# Altium project SensorModule_Digital.PrjPcb
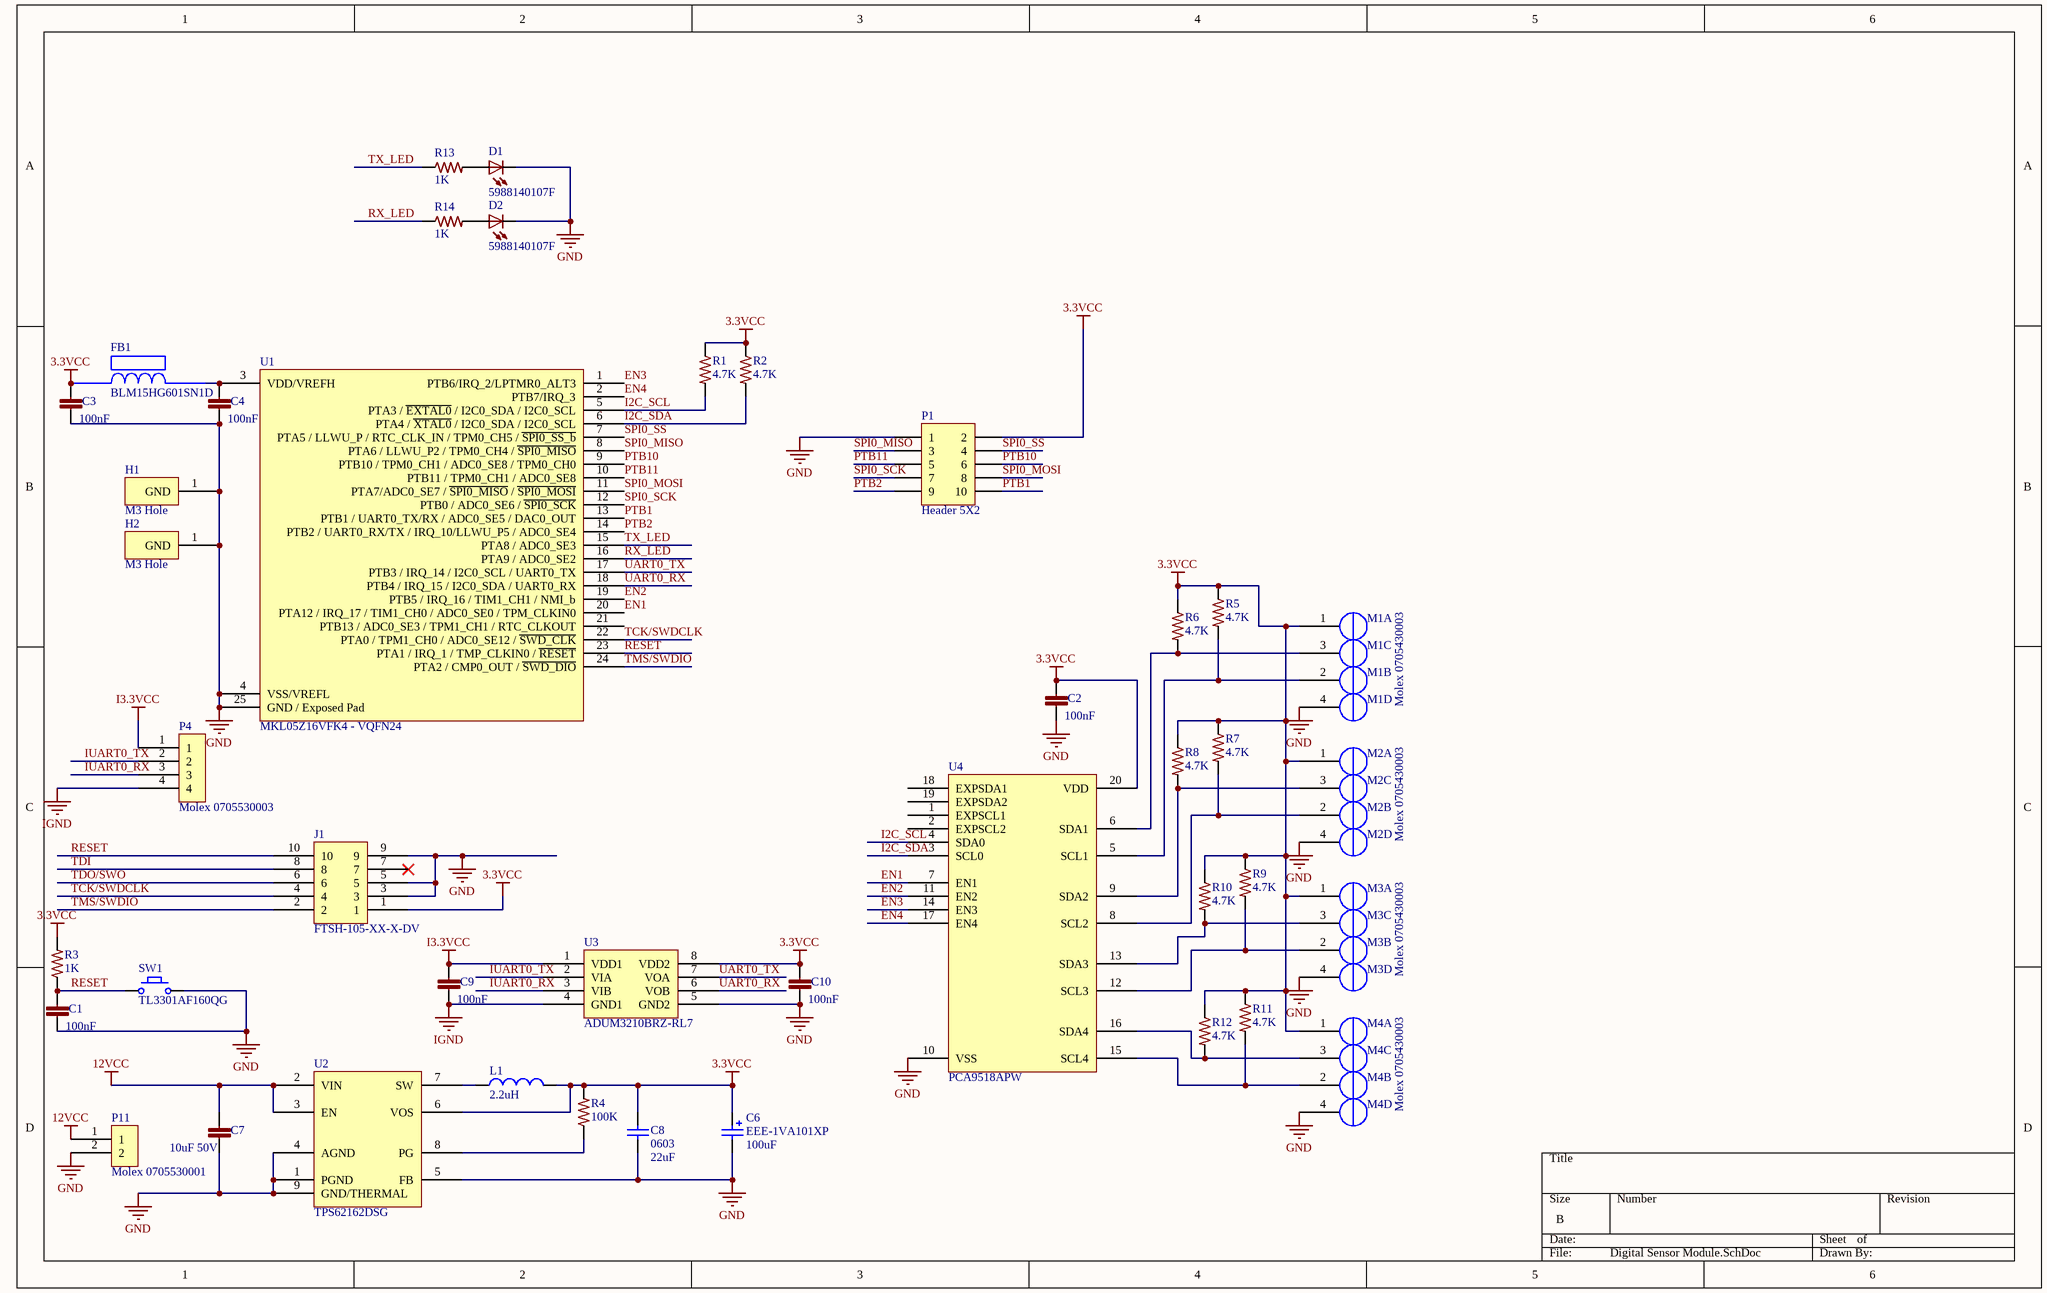
[diagram p0: Digital Sensor Module.SchDoc]
1 sheet, 42 parts. Net scope: global (net labels, ports and power ports of the same name join across sheets).
Board file: Digital Sensor Module.PcbDoc

## Sheet Digital Sensor Module.SchDoc
size B

### Parts
C1  100nF  [C0402]
C2  100nF  [C0402]
C3  100nF  [C0402]
C4  100nF  [C0402]
C6  EEE-1VA101XP  value 100uF  [EEE-1VA101XP]
C7  10uF 50V  [C1206]
C8  0603  value 22uF  [C0805]
C9  100nF  [C0402]
C10  100nF  [C0402]
D1  5988140107F  [LED2012120]
D2  5988140107F  [LED2012120]
FB1  BLM15HG601SN1D  [BLM18PG121SN1D]
H1  M3 Hole  [Hole-3mm]
H2  M3 Hole  [Hole-3mm]
J1  FTSH-105-XX-X-DV  [FTSH-105-XX-X-DV]
L1  value 2.2uH  [VLS252012T-2R2M1R3]  (hidden comment: VLS252012T-2R2M1R3)
M1  Molex 0705430003  [4POL254]  (parts A,B,C,D of 4)
M2  Molex 0705430003  [4POL254]  (parts A,B,C,D of 4)
M3  Molex 0705430003  [4POL254]  (parts A,B,C,D of 4)
M4  Molex 0705430003  [4POL254]  (parts A,B,C,D of 4)
P1  Header 5X2  [HDR2X5]
P4  Molex 0705530003  [0705530003]
P11  Molex 0705530001  [0705530001]
R1  4.7K  [R0603]
R2  4.7K  [R0603]
R3  1K  [R0603]
R4  100K  [R0603]
R5  4.7K  [R0603]
R6  4.7K  [R0603]
R7  4.7K  [R0603]
R8  4.7K  [R0603]
R9  4.7K  [R0603]
R10  4.7K  [R0603]
R11  4.7K  [R0603]
R12  4.7K  [R0603]
R13  1K  [R0603]
R14  1K  [R0603]
SW1  TL3301AF160QG  [TL3301AF160QG]
U1  MKL05Z16VFK4 - VQFN24  [98ASA00474D]
U2  TPS62162DSG  [DSG8-1600X900TP]
U3  ADUM3210BRZ-RL7  [ADUM3210BRZ-RL7]
U4  PCA9518APW  [PCA9518APW,512]

### Nets
3.3VCC: C2.1 C3.1 C6.1 C8.2 C10.1 FB1.1 J1.1 L1.2 M1.1(OUT2B) M2.1(OUT2B) M3.1(OUT2B) M4.1(OUT2B) P1.2 R1.1 R2.1 R3.2 R4.2 R5.1 R6.1 R7.1 R8.1 R9.1 R10.1 R11.1 R12.1 U2.6(VOS) U3.8(VDD2) U4.20(VDD)
12VCC: C7.1 P11.1 U2.2(VIN) U2.3(EN)
GND: C1.2 C2.2 C3.2 C4.2 C6.2 C7.2 C8.1 C10.2 D1.C D2.C H1.1(GND) H2.1(GND) J1.3 J1.5 J1.9 M1.4(OUT1B) M2.4(OUT1B) M3.4(OUT1B) M4.4(OUT1B) P1.1 P11.2 SW1.2 U1.4(VSS/VREFL) U1.25(GND_/_Exposed_Pad) U2.1(PGND) U2.4(AGND) U2.5(FB) U2.9(GND/THERMAL) U3.5(GND2) U4.10(VSS)
I3.3VCC: C9.1 P4.1 U3.1(VDD1)
IGND: C9.2 P4.4 U3.4(GND1)
EN1: U1.20(PTA12_/_IRQ_17_/_TIM1_CH0_/_ADC0_SE0_/_TPM_CLKIN0) U4.7(EN1)
EN2: U1.19(PTB5_/_IRQ_16_/_TIM1_CH1_/_NMI_b) U4.11(EN2)
EN3: U1.1(PTB6/IRQ_2/LPTMR0_ALT3) U4.14(EN3)
EN4: U1.2(PTB7/IRQ_3) U4.17(EN4)
I2C_SCL: R1.2 U1.5(PTA3_/_~{EXTAL0}_/_I2C0_SDA_/_I2C0_SCL) U4.4(SDA0)
I2C_SDA: R2.2 U1.6(PTA4_/_~{XTAL0}_/_I2C0_SDA_/_I2C0_SCL) U4.3(SCL0)
IUART0_RX: P4.3 U3.3(VIB)
IUART0_TX: P4.2 U3.2(VIA)
PTB1: P1.10 U1.13(PTB1_/_UART0_TX/RX_/_ADC0_SE5_/_DAC0_OUT)
PTB2: P1.9 U1.14(PTB2_/_UART0_RX/TX_/_IRQ_10/LLWU_P5_/_ADC0_SE4)
PTB10: P1.6 U1.9(PTB10_/_TPM0_CH1_/_ADC0_SE8_/_TPM0_CH0)
PTB11: P1.5 U1.10(PTB11_/_TPM0_CH1_/_ADC0_SE8)
RESET: C1.1 J1.10 R3.1 SW1.1 U1.23(PTA1_/_IRQ_1_/_TMP_CLKIN0_/_~{RESET})
RX_LED: R14.1 U1.16(PTA9_/_ADC0_SE2)
SPI0_MISO: P1.3 U1.8(PTA6_/_LLWU_P2_/_TPM0_CH4_/_~{SPI0_MISO})
SPI0_MOSI: P1.8 U1.11(PTA7/ADC0_SE7_/_~{SPI0_MISO}_/_~{SPI0_MOSI})
SPI0_SCK: P1.7 U1.12(PTB0_/_ADC0_SE6_/_~{SPI0_SCK})
SPI0_SS: P1.4 U1.7(PTA5_/_LLWU_P_/_RTC_CLK_IN_/_TPM0_CH5_/_~{SPI0_SS_b})
TCK/SWDCLK: J1.4 U1.22(PTA0_/_TPM1_CH0_/_ADC0_SE12_/_~{SWD_CLK})
TDI: J1.8
TDO/SWO: J1.6
TMS/SWDIO: J1.2 U1.24(PTA2_/_CMP0_OUT_/_~{SWD_DIO})
TX_LED: R13.1 U1.15(PTA8_/_ADC0_SE3)
UART0_RX: U1.18(PTB4_/_IRQ_15_/_I2C0_SDA_/_UART0_RX) U3.6(VOB)
UART0_TX: U1.17(PTB3_/_IRQ_14_/_I2C0_SCL_/_UART0_TX) U3.7(VOA)
NetC4_1: C4.1 FB1.2 U1.3(VDD/VREFH)
NetD1_A: D1.A R13.2
NetD2_A: D2.A R14.2
NetL1_1: L1.1 U2.7(SW)
NetM1_2: M1.2(OUT2A) R5.2 U4.5(SCL1)
NetM1_3: M1.3(OUT1A) R6.2 U4.6(SDA1)
NetM2_2: M2.2(OUT2A) R7.2 U4.8(SCL2)
NetM2_3: M2.3(OUT1A) R8.2 U4.9(SDA2)
NetM3_2: M3.2(OUT2A) R9.2 U4.12(SCL3)
NetM3_3: M3.3(OUT1A) R10.2 U4.13(SDA3)
NetM4_2: M4.2(OUT2A) R11.2 U4.15(SCL4)
NetM4_3: M4.3(OUT1A) R12.2 U4.16(SDA4)
NetR4_1: R4.1 U2.8(PG)

Not connected (* = marked no-connect by the designer): J1 7*; U1 21(PTB13_/_ADC0_SE3_/_TPM1_CH1_/_RTC_CLKOUT); U4 1(EXPSCL1) 2(EXPSCL2) 18(EXPSDA1) 19(EXPSDA2)

### Library data of the parts
C1-C4 C9 C10 = GRM155R71C104KA88D: CAP CER 0402 100nF 16V 10% X7R; LastRevisionNote: ImportComponents; Published: 23-Apr-2014; Publisher: UltiMachine; LastRevisionDate: 23-Apr-2014; ManufacturerPartNumber: GRM155R71C104KA88D; VALUE: 100nF
C6 = EEE-1VA101XP: CAP ALUM 100UF 35V 20% SMD; Manufacture: Panasonic; Digikey Part #: PCE3951CT-ND; Price: $0.63; Mount Type: SMT Panasonic VS D Series; Status: Active; Height: 7.70mm; Datasheet: http://industrial.panasonic.com/www-cgi/jvcr13pz.cgi?E+PZ+3+ABA0002+EEE1VA101XP+7+WW; Manufacture Part #: EEE-1VA101XP
C7 = CL31A106KBHNNNE: CAP CER 10UF 50V 10% X5R 1206; Manufacturer: Samsung; LastRevisionNote: ImportComponents; Published: 25-mar-2015; Publisher: UltiMachine; LastRevisionDate: 25-mar-2015; ManufacturerPartNumber: CL31A106KBHNNNE; VALUE: 10uF 50V
C8 = CL21A226KQQNNNE: CAP CER 22UF 6.3V 10% X5R 0805; MFR: Samsung; Voltage: 6.3VDC; Published: April 2015; LatestRevisionDate: April 2015; Component Type: Chip Capacitor; MFR Part #: CL21A226KQQNNNE; Part Description: CAP CER 22UF 6.3V 10% X5R 0805; Mounting Type: SMT 0805; Datasheet: http://www.digikey.com/product-detail/en/CL21A226KQQNNNE/1276-2907-2-ND/3888565; Height: 1mm; Tolerance: 10%; Digikey #: 1276-2907-2-ND; PackageReference: 0805
D1 D2 = 5988140107F: LED 0805 Yellow; LastRevisionNote: ImportComponents; Published: 23-Apr-2014; Publisher: UltiMachine; LastRevisionDate: 23-Apr-2014; VALUE: 5988140107F
H1 H2 = Hole: 3mm Hole
J1 = ARM Cortex JTAG-DEBUG Header
L1 = VLS252012T-2R2M1R3: MFR: TDK Corporation; Published: April 2015; LatestRevisionDate: April 2015; LatestRevisionNote: IPC-7351 Footprint Added.; PackageReference: Custom Wound INductor; Publisher: Adam Vadala-Roth; PackageDescription: Wire Wound Inductor Package; MFR#: VLS252012T-2R2M1R3
M1-M4 = Molex 0705430003 Alt: Molex 4 Pin Clip Connector
P1 = Header 5X2: Header, 5-Pin, Dual row; LatestRevisionDate: 17-Jul-2002; LatestRevisionNote: Re-released for DXP Platform.; Publisher: Altium Limited
P4 = 0705530003: Molex 0705530003 Right Angle 2.54mm Shrouded Header; MFR: Molex; MFR#: 0705530003; Type: 2.54mm shrouded 4 pin right angle throughhole connector; Digikey #: WM4902-ND
P11 = 0705530001: Molex 0705530002 Right Angle 2.54mm Shrouded Header; MFR: Molex; MFR#: 0705530001; Type: 2.54mm shrouded 2 pin right angle throughhole connector; Digikey #: WM4900-ND
R1 R2 R5-R12 = ERJ3EKF4701V: RES 0603 4.7K 100mW 1%; LastRevisionNote: ImportComponents; Published: 23-Apr-2014; Publisher: UltiMachine; LastRevisionDate: 23-Apr-2014; ManufacturerPartNumber: ERJ3EKF4701V; VALUE: 4.7K
R3 R13 R14 = ERJ-3EKF1001V: RES 0603 1K 100mW 1%; LastRevisionNote: ImportComponents; Published: 23-Apr-2014; Publisher: UltiMachine; LastRevisionDate: 23-Apr-2014; ManufacturerPartNumber: ERJ-3EKF1001V; VALUE: 1K
R4 = RC0603FR-07100KL: RES 100K OHM 1/10W 1% 0603 SMD; LastRevisionNote: ImportComponents; Published: 23-Apr-2014; Publisher: UltiMachine; LastRevisionDate: 23-Apr-2014; ManufacturerPartNumber: RC0603FR-07100KL; VALUE: 100K
U1 = MKL05Z16VFK4 - 24 Pin VQFN: ARM Cortex M0+
U2 = TPS62162SOP
U3 = ADUM3210BRZ-RL7: DGTL ISO 2.5KV GEN PURP 8SOIC; MFR: Analog Devices; RHoS?: yes; MFR#: ADUM3210BRZ-RL7; Digikey #: ADUM3210BRZ-RL7CT-ND; Type: 8 pin SOIC; Revision Date: April 2015
U4 = PCA9518APW512: IC I2C HUB 5CH EXPANDBL 20-TSSOP; MFR: NXP; MFR#: PCA9518APW,512; Type: I2C Hub SOIC8; Date Added: April 2015; Digikey#: 568-4245-5-ND
SW1 = TL3301AF160QG: MFR: *; MFR#: TL3301AF160QG; Type: SMD Momentary Tactile Switch; Height: *